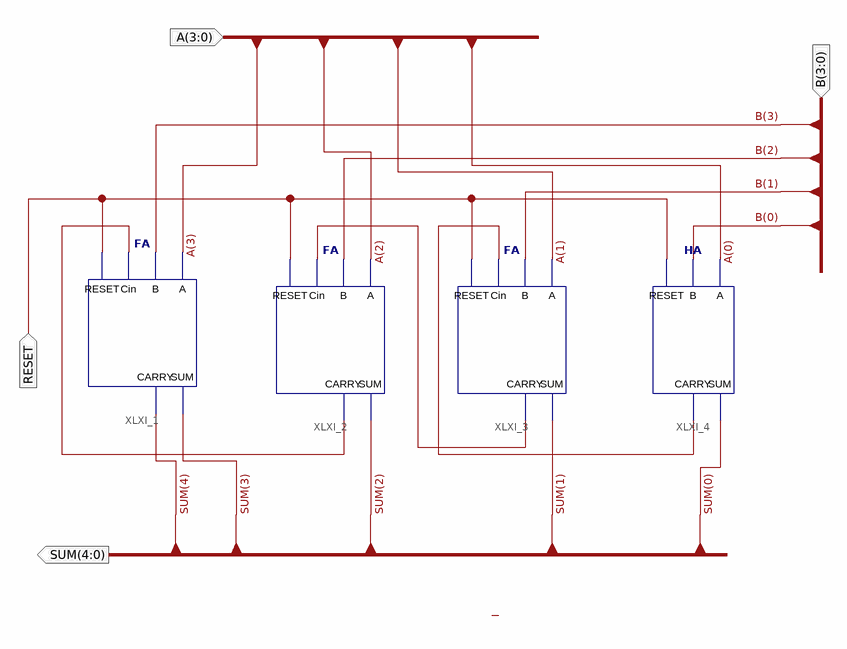
[diagram p0: schematic sheet 1]
// Xilinx ISE schematic Four_Bit_Adder.sch (artix7) as structural Verilog: 4 symbols, 4 ports
module Four_Bit_Adder (
  input  RESET,
  input  [3:0] B,
  input  [3:0] A,
  output [4:0] SUM
);

  wire XLXN_4, XLXN_5, XLXN_6;

  FA XLXI_1 (.A(A[3]), .B(B[3]), .CARRY(SUM[4]), .Cin(XLXN_6), .RESET(RESET), .SUM(SUM[3]));
  FA XLXI_2 (.A(A[2]), .B(B[2]), .CARRY(XLXN_6), .Cin(XLXN_5), .RESET(RESET), .SUM(SUM[2]));
  FA XLXI_3 (.A(A[1]), .B(B[1]), .CARRY(XLXN_5), .Cin(XLXN_4), .RESET(RESET), .SUM(SUM[1]));
  HA XLXI_4 (.A(A[0]), .B(B[0]), .CARRY(XLXN_4), .RESET(RESET), .SUM(SUM[0]));
endmodule
